# EAGLE design mainboard (EAGLE 7.4.0)
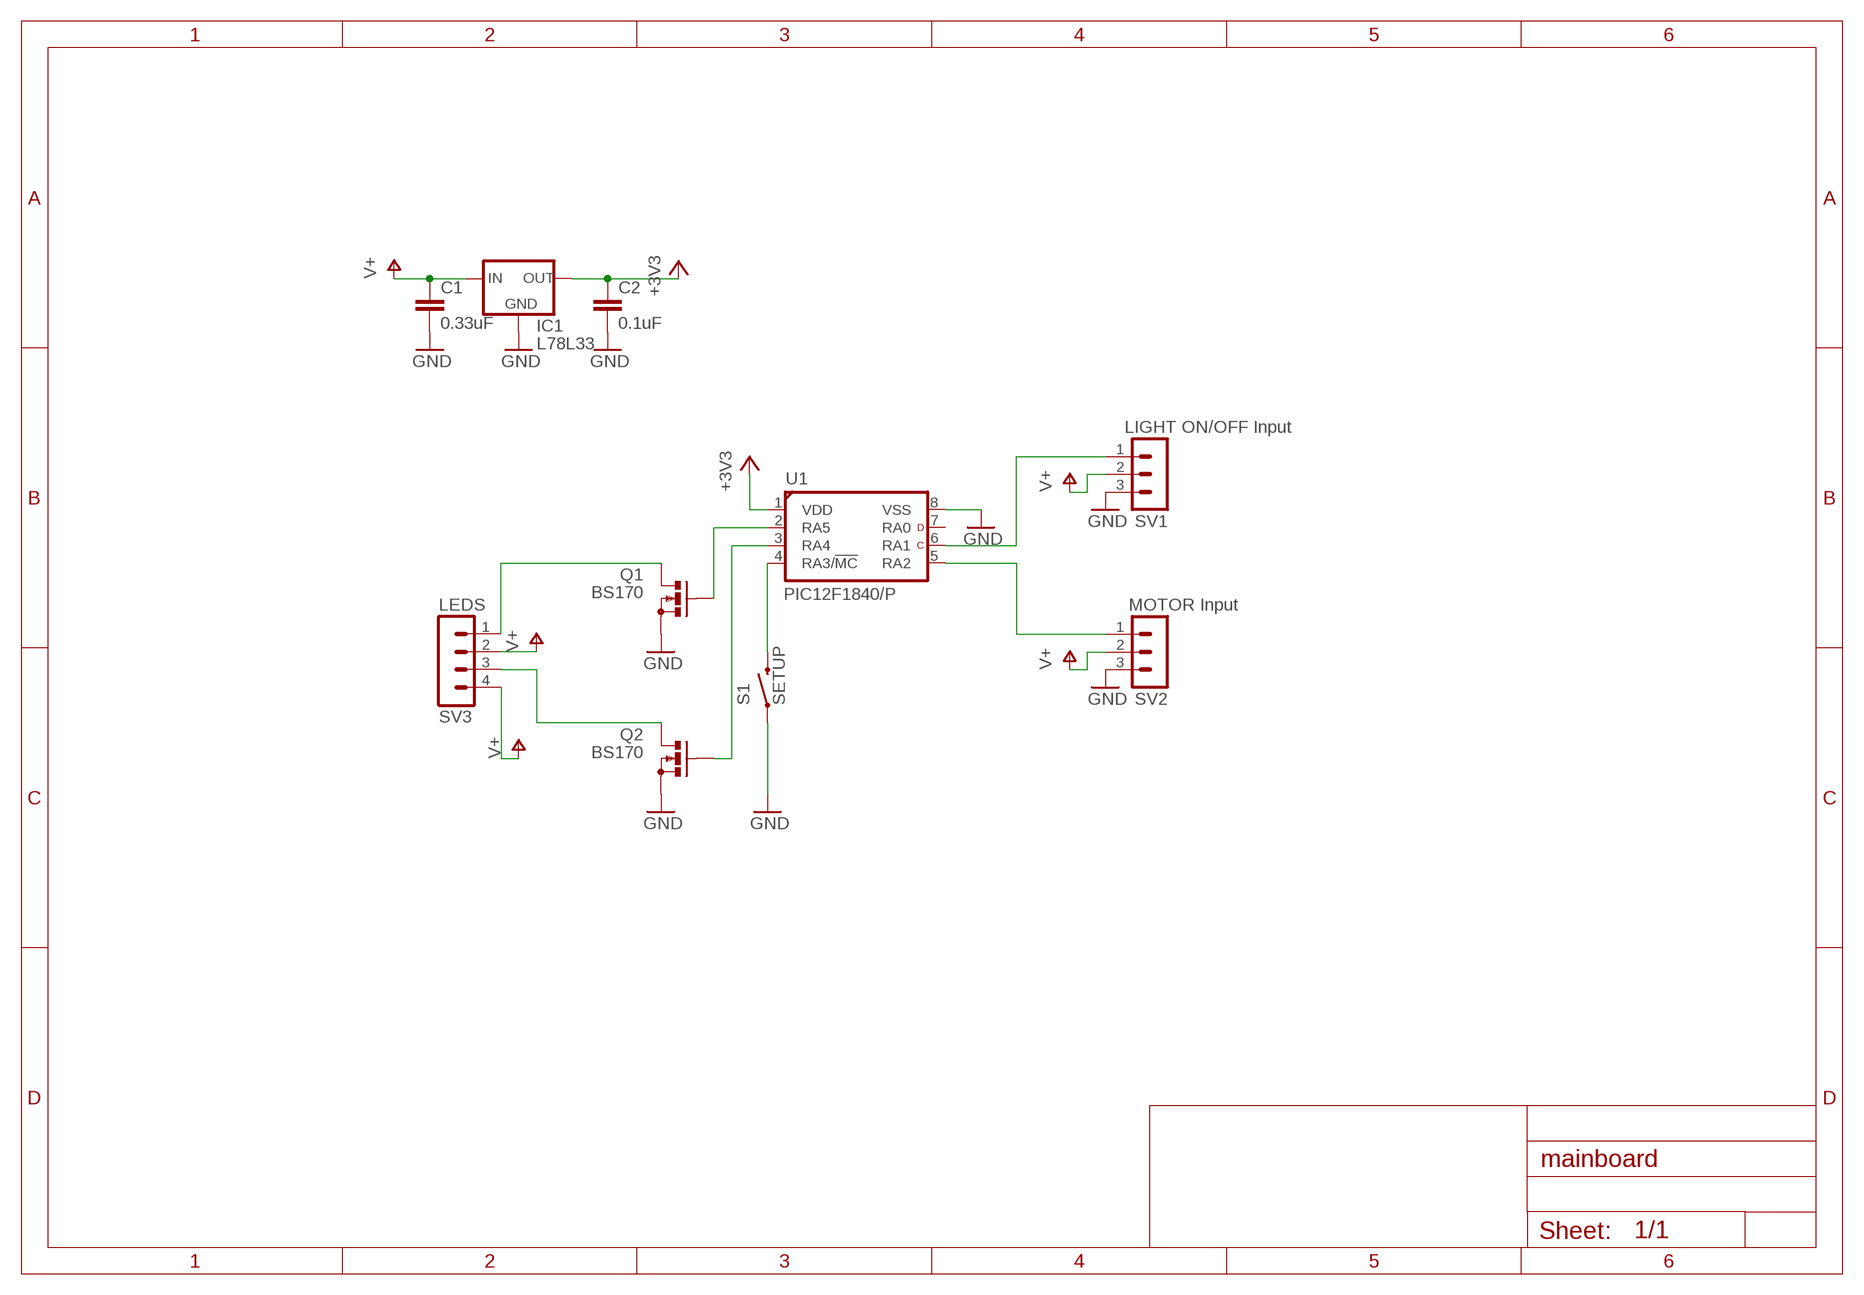
[diagram p0: schematic, sheet 1]

## Parts
C1  0.33uF  C-EU025-025X050  [C025-025X050]
C2  0.1uF  C-EU025-025X050  [C025-025X050]
IC1  L78L33  78LXX  [78LXX]
Q1  BS170  [SOT54E]
Q2  BS170  [SOT54E]
S1  SETUP  SWITCH-MOMENTARY-2PTH  [TACTILE-PTH]
SV1  LIGHT ON/OFF Input  MA03-1  [MA03-1]
SV2  MOTOR Input  MA03-1  [MA03-1]
SV3  LEDS  MA04-1  [MA04-1]
U1  PIC12F1840/P  [DIL8-P]

## Nets
+3V3: C2.1 IC1.OUT U1.1(VDD)
GND: C1.2 C2.2 IC1.GND Q1.S Q2.S S1.1 SV1.3 SV2.3 U1.8(VSS)
N$1: Q1.D SV3.1
N$7: Q1.G U1.2(RA5)
N$8: Q2.G U1.3(RA4)
N$11: Q2.D SV3.3
N$14: SV2.1 U1.5(RA2)
N$15: SV1.1 U1.6(RA1)
N$16: S1.3 U1.4(RA3/!MC!)
V+: C1.1 IC1.IN SV1.2 SV2.2 SV3.2 SV3.4
Unconnected: U1.7(RA0)

## Library data of the parts
C1 C2 = resistor:C-EU: CAPACITOR, European symbol
IC1 = v-reg:78LXX: VOLTAGE REGULATOR
Q1 Q2 = transistor-small-signal:BS170: N-CHANNEL MOS FET
S1 = SparkFun-Electromechanical:SWITCH-MOMENTARY-2: Various NO switches- pushbuttons, reed, etc; PROD_ID: SWCH-08441
SV1 SV2 = con-lstb:MA03-1: PIN HEADER; OC_FARNELL: unknown; OC_NEWARK: unknown
SV3 = con-lstb:MA04-1: PIN HEADER; OC_FARNELL: unknown; OC_NEWARK: unknown
U1 = microchip_pic12f:PIC12*F1840: Low pincount microcontroller http://www.microchip.com/wwwproducts/Devices.aspx?product=PIC12F1840 Properties Parameter Name Value Program Memory Type Flash Program Memory (KB) 7 CPU Speed (MIPS) 8 RAM Bytes 256 Data EEPROM (bytes) 256 Digital Communication Peripherals 1-UART, 1-A/E/USART, 1-SPI, 1-I2C1-MSSP(SPI/I2C) Capture/Compare/PWM Peripherals 1 ECCP / Timers 2 x 8-bit, 1 x 16-bit ADC 4 ch, 10-bit Comparators 1 Temperature Range (C) -40 to 125 Operating Voltage Range (V) 1.8 to 5.5 Pin Count 8 XLP Yes Cap Touch Channels 4 Features Enhanced Mid-range Core with 49 Instruction, 16 Stack Levels Flash Program Memory with self read/write capability Internal 32MHz oscillator Integrated Capacitive mTouch Sensing Module Data Signal Modulator Module MI2C, SPI, EUSART w/auto baud ECCP (Enhanced/Capture Compare PWM) Module Comparator with selectable Voltage Reference 4 Channel 10b ADC with Voltage Reference 25mA Source/Sink current I/O Two 8-bit Timers (TMR0/TMR2) One 16-bit Timer (TMR1) Extended Watchdog Timer (EWDT) Enhanced Power-On/Off-Reset Brown-Out Reset (BOR) In Circuit Serial Programming (ICSP) On Board In-Circuit Debug Wide Operating Voltage (1.8V – 5.5V) Low Power PIC12LF182x variants (1.8V – 3.6V) Standby Current (PIC12LF1840): 20 nA @ 1.8V, typical Active Current (PIC12LF1840): 50uA/MHz @ 1.8V, typical Library from www.mikroelektroniikka.fi/lbr

## Net classes
1 power: width 0.406 mm

## Board
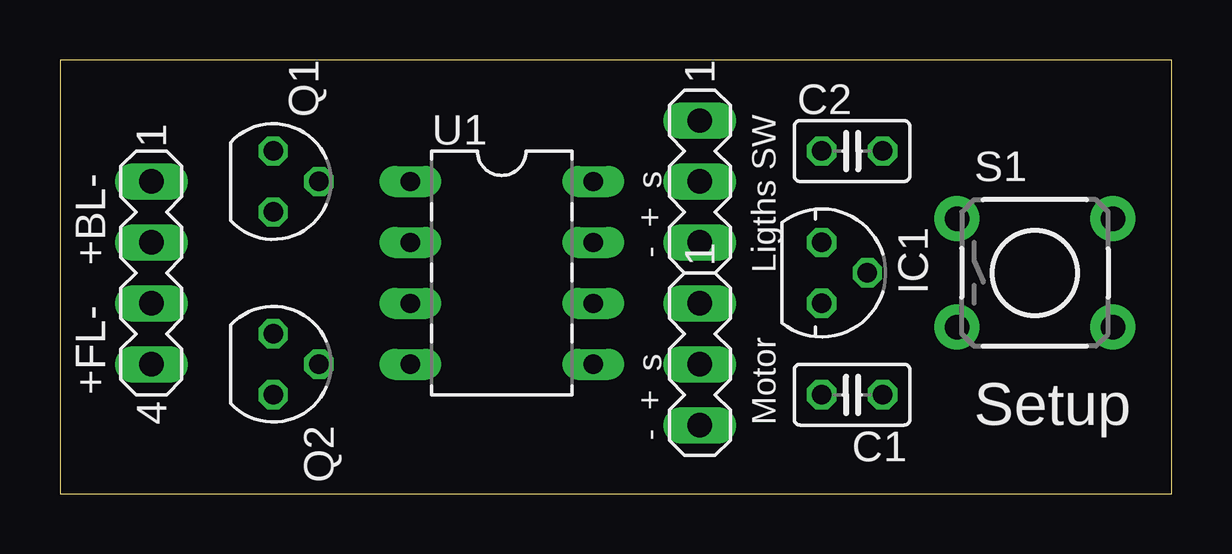
[diagram p1: board, top side]
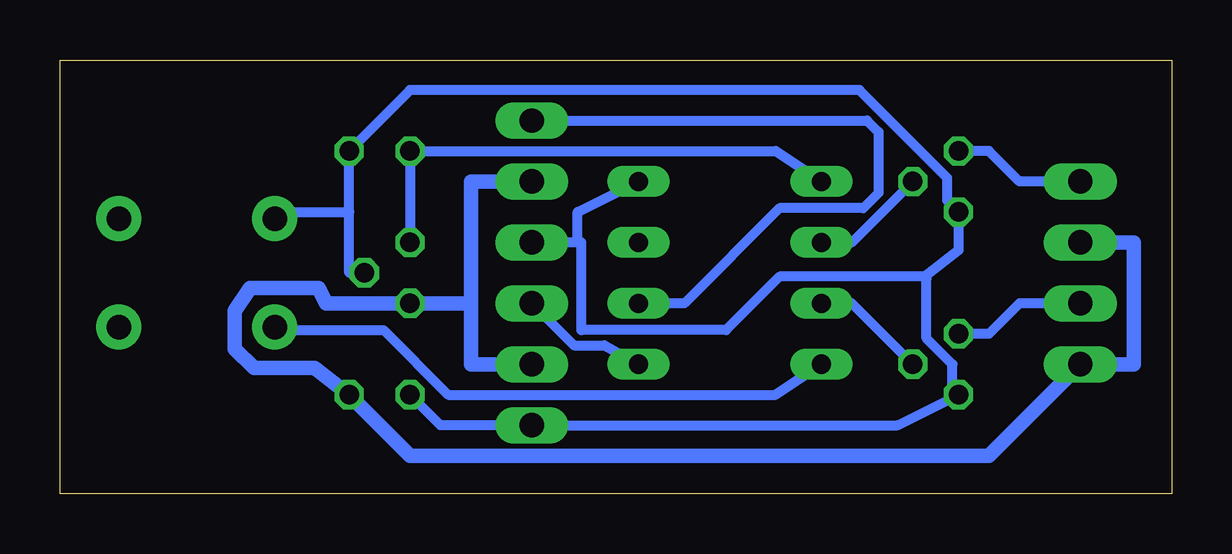
[diagram p2: board, bottom side, seen from below]

Size 46.34 x 18.09 mm. Coordinates in mm from the lower left corner, seen from the top.
Outline: 0,0 46.34,0 46.34,18.09 0,18.09 0,0
Copper layers (1*16): Top 0.0356mm / dielectric 1.5011mm / Bottom 0.0356mm
Design rules "default *": minimum track width 6mil, minimum drill 13mil, track to track 6mil, track to pad 6mil, pad to pad 6mil, via to via 6mil, smd to smd 6mil, copper to edge 15mil, drill to drill 6mil, minimum pad ring 7mil, minimum via ring 7mil, stop-mask expansion 3mil, vias tented up to drill 0mil, thermal gap 10mil

### Footprints (pad centres in the part's own frame; a part is rotated, then mirrored left to right if it is on the bottom)
C025-025X050 = drill 0.813 octagon: 1 -1.27,0; 2 1.27,0
78LXX = drill 0.813 octagon: GND 0,1.905; IN 1.27,0; OUT -1.27,0
SOT54E = drill 0.813 octagon: D -1.27,0; G 0,1.905; S 1.27,0
TACTILE-PTH = drill 1.016 pad 1.88: 1 -3.251,2.261; 2 3.251,2.261; 3 -3.251,-2.261; 4 3.251,-2.261
MA03-1 = drill 1.016 long: 1 -2.54,0; 2 0,0; 3 2.54,0
MA04-1 = drill 1.016 long: 1 -3.81,0; 2 -1.27,0; 3 1.27,0; 4 3.81,0
DIL8-P = drill 0.8 pad 1.3 long: 1 -3.81,-3.81; 2 -1.27,-3.81; 3 1.27,-3.81; 4 3.81,-3.81; 5 3.81,3.81; 6 1.27,3.81; 7 -1.27,3.81; 8 -3.81,3.81

### Placement (x,y rotation side)
C1  33.02,4.13 180 top
C2  33.02,14.29 0 top
IC1  31.75,9.21 270 top
Q1  8.89,13.02 270 top
Q2  8.89,5.4 270 top
S1  40.64,9.21 0 top
SV1  26.67,13.02 270 top
SV2  26.67,5.4 270 top
SV3  3.81,9.21 270 top
U1  18.41,9.21 270 top

### Tracks (layer width: path | path; a pad name or v marks a point on that pad's centre or on a via)
+3V3
  Bottom 0.406: U1.1 16.51,14.29 C2.1 IC1.OUT
GND
  Bottom 0.406: 24.77,10.48 24.77,11.75 U1.8 | C1.2 30.48,2.86 SV2.3 11.43,2.86 Q2.S 9.14,4.13 9.14,5.4 10.22,6.48 10.22,8.95 10.32,9.05 | 10.32,9.05 16.35,9.05 18.57,6.83 24.61,6.83 24.61,10.48 24.77,10.48 | 24.77,10.48 SV1.3 | IC1.GND 34.29,9.21 34.29,11.75 | 34.29,11.75 C2.2 31.75,16.83 13.02,16.83 9.37,13.18 9.37,12.22 Q1.S 8.89,10.16 10.32,9.05 | S1.1 37.39,11.75 34.29,11.75
N$1
  Bottom 0.406: SV3.1 6.35,13.02 7.62,14.29 Q1.D
N$7
  Bottom 0.406: U1.2 13.34,10.48 Q1.G
N$8
  Bottom 0.406: U1.3 13.34,7.94 Q2.G
N$11
  Bottom 0.406: SV3.3 6.35,7.94 7.62,6.67 Q2.D
N$14
  Bottom 0.406: U1.5 23.65,6.19 24.92,6.19 SV2.1
N$15
  Bottom 0.406: U1.6 20.32,7.94 16.35,11.91 12.86,11.91 12.22,12.54 12.22,15.08 12.7,15.56 SV1.1
N$16
  Bottom 0.406: U1.4 16.51,4.13 30.16,4.13 32.86,6.83 37.31,6.83 S1.3
V+
  Bottom 0.61: SV3.2 1.59,10.48 1.59,5.4 SV3.4 7.62,1.59 31.75,1.59 C1.1 35.72,5.24 38.26,5.24 39.05,6.03 39.05,7.62 38.42,8.57 35.56,8.57 35.24,7.94 IC1.IN 29.21,7.94 | SV2.2 29.21,5.4 29.21,7.94 | 29.21,7.94 29.21,13.02 SV1.2

### Text on the board
tPlace: +BL- | - + s | Ligths SW | +FL- | - + s | Motor | Setup